# Altium schematic sheet BLE_ADS.SchDoc
size A
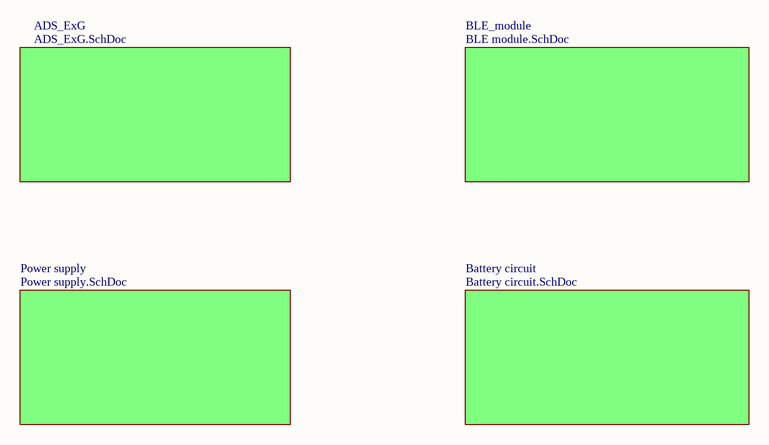
[diagram p0: BLE_ADS.SchDoc]

## Sub-sheets
ADS_ExG = ADS_ExG.SchDoc: no entries
Battery circuit = Battery circuit.SchDoc: no entries
BLE_module = BLE module.SchDoc: no entries
Power supply = Power supply.SchDoc: no entries